# Altium schematic sheet pagerv2IO.SchDoc
size A4; SheetNumber: 2; SheetTotal: 2
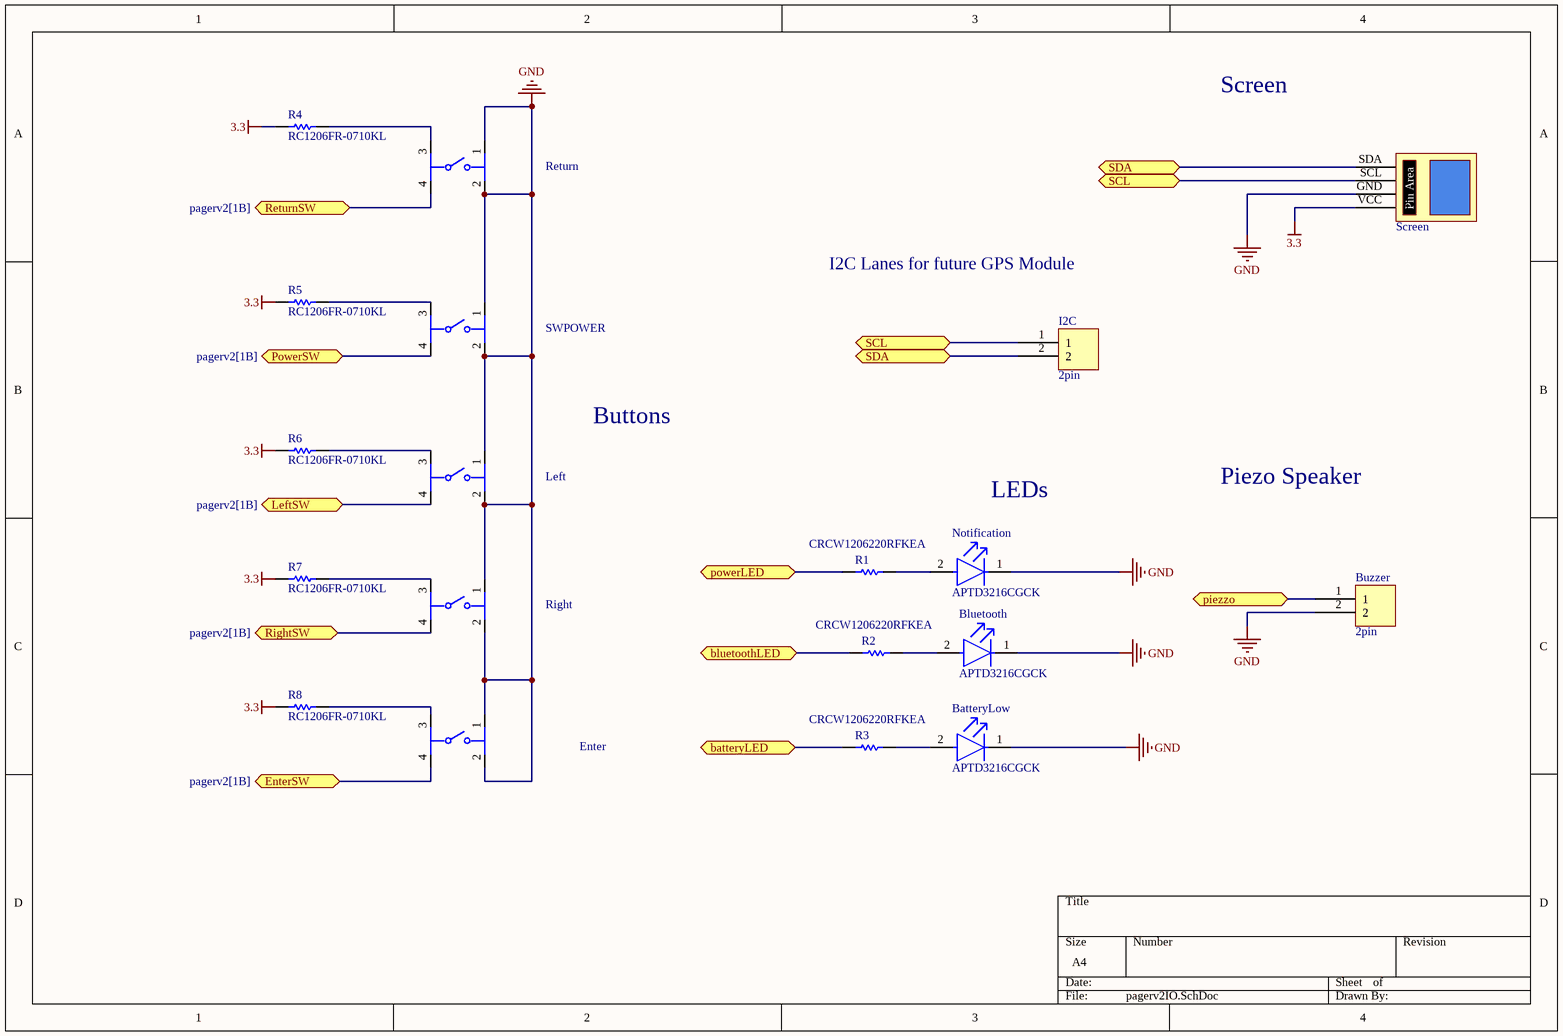
[diagram p0: pagerv2IO.SchDoc]

## Parts
?  Screen  [Screen]
BatteryLow  APTD3216CGCK  [FP-APTD3216CGCK-MFG]
Bluetooth  APTD3216CGCK  [FP-APTD3216CGCK-MFG]
Buzzer  2pin  [2PIN]
Enter  PTS645SH50SMTR92LFS  [FP-PTS645SH50SMTR92LFS-MFG]  (value not drawn)
I2C  2pin  [2PIN]
Left  PTS645SH50SMTR92LFS  [FP-PTS645SH50SMTR92LFS-MFG]  (value not drawn)
Notification  APTD3216CGCK  [FP-APTD3216CGCK-MFG]
R1  CRCW1206220RFKEA  [RESC3216X60X45ML10T20]
R2  CRCW1206220RFKEA  [RESC3216X60X45ML10T20]
R3  CRCW1206220RFKEA  [RESC3216X60X45ML10T20]
R4  RC1206FR-0710KL  [RESC3116X65X40ML10T20]
R5  RC1206FR-0710KL  [RESC3116X65X40ML10T20]
R6  RC1206FR-0710KL  [RESC3116X65X40ML10T20]
R7  RC1206FR-0710KL  [RESC3116X65X40ML10T20]
R8  RC1206FR-0710KL  [RESC3116X65X40ML10T20]
Return  PTS645SH50SMTR92LFS  [FP-PTS645SH50SMTR92LFS-MFG]  (value not drawn)
Right  PTS645SH50SMTR92LFS  [FP-PTS645SH50SMTR92LFS-MFG]  (value not drawn)
SWPOWER  PTS645SH50SMTR92LFS  [FP-PTS645SH50SMTR92LFS-MFG]  (value not drawn)

## Ports
batteryLED (bidir, see pagerv2[1B]), bluetoothLED (bidir, see pagerv2[1B]), EnterSW (bidir, see pagerv2[1B]), LeftSW (bidir, see pagerv2[1B]), piezzo (bidir, see pagerv2[2B]), powerLED (bidir, see pagerv2[1B]), PowerSW (bidir, see pagerv2[1B]), ReturnSW (bidir, see pagerv2[1B]), RightSW (bidir, see pagerv2[1B]), SCL (bidir, see pagerv2[2B], pagerv2IO[3A]), SCL (bidir, see pagerv2[2B], pagerv2IO[3B]), SDA (bidir, see pagerv2[2B], pagerv2IO[3A]), SDA (bidir, see pagerv2[2B], pagerv2IO[3B])

## Nets
3.3: ?.VCC(4) R4.1 R5.1 R6.1 R7.1 R8.1
GND: ?.GND(3) BatteryLow.1(C) Bluetooth.1(C) Buzzer.2 Enter.1 Enter.2 Left.1 Left.2 Notification.1(C) Return.1 Return.2 Right.1 Right.2 SWPOWER.1 SWPOWER.2
batteryLED: R3.1 ; port batteryLED
bluetoothLED: R2.1 ; port bluetoothLED
EnterSW: Enter.4 ; port EnterSW
LeftSW: Left.4 ; port LeftSW
piezzo: Buzzer.1 ; port piezzo
powerLED: R1.1 ; port powerLED
PowerSW: SWPOWER.4 ; port PowerSW
ReturnSW: Return.4 ; port ReturnSW
RightSW: Right.4 ; port RightSW
SCL: ?.SCL(2) I2C.1 ; port SCL
SDA: ?.SDA(1) I2C.2 ; port SDA
NetBatteryLow_2: BatteryLow.2(A) R3.2
NetBluetooth_2: Bluetooth.2(A) R2.2
NetEnter_3: Enter.3 R8.2
NetLeft_3: Left.3 R6.2
NetNotification_2: Notification.2(A) R1.2
NetR4_2: R4.2 Return.3
NetR5_2: R5.2 SWPOWER.3
NetR7_2: R7.2 Right.3

## Notes on the sheet
- Screen
- I2C Lanes for future GPS Module
- Buttons
- LEDs
- Piezo Speaker
- (in symbol Screen) Pin Area

## Library data of the parts
BatteryLow Bluetooth Notification = CMP-2000-05792-2: LED GREEN CLEAR 2SMD; Forward Voltage: 2.1V; Forward Current: 20mA; Luminous Intensity: 300mcd; Number of LEDs: 1; Dominant Wavelength: 570nm; Viewing Angle: 50°; Lead Free: Lead Free; Lens Color: Clear; Mount: Surface Mount; Package Quantity: 2000; Height: 1.8mm; Number of Pins: 2; Test Current: 20mA; Case Code (Metric): 3216; Case/Package: 1206; Case Code (Imperial): 1206; Illumination Color: Green; Color: Green; Width: 1.6mm; Packaging: Tape and Reel; Min Operating Temperature: -40°C; Lens Style: Clear; Max Operating Temperature: 85°C; Length: 3.2mm
Enter Left Return Right SWPOWER = CMP-10040-000028-1: SWITCH TACTILE SPST-NO 0.05A 12V; Operating Force: 200gf; Current Rating: 50mA; Illumination Type: Non-Illuminated; Actuator Material: Nylon; Throw Configuration: SPST; Switch Function: Off-Mom; Mechanical Life: 100000Cycles; Actuator Type: Standard; Packaging: Tape and Reel; Termination: Gull Wing; Max Operating Temperature: 60°C; Length: 6mm; REACH SVHC: No SVHC; Orientation: Straight; Max Voltage Rating (DC): 12V; Package Quantity: 1000; Max Current Rating: 50mA; Mount: Surface Mount; Contact Material: Bronze; Case/Package: SMD/SMT; Lead Free: Lead Free; Min Operating Temperature: -20°C; Contact Plating: Silver; Color: Black; Depth: 9mm; Voltage Rating (DC): 12V
R1-R3 = CMP-2003-01956-1: Manufacturer: Vishay Dale; Part Number: CRCW1206220RFKEA
R4-R8 = CMP-1014-00623-2: Chip Resistor, 10 KOhm, +/- 1%, 0.25 W, -55 to 155 degC, 1206 (3216 Metric), RoHS, Tape and Reel; Manufacturer: Yageo; Voltage Rating: 200V; Resistance: 10KOhm; Temperature Coefficient: 100ppm/degreesC; Power Rating: 250mW; Packaging: TapeandReel; Termination: SMD/SMT; REACH SVHC: Unknown; Tolerance: 1%; Height: 0.55mm; Composition: ThickFilm; Max Operating Temperature: 155degC; Datasheet Version: Rev. 5, 10/2016; Lead Free: LeadFree; Case Code (Metric): 3216; Depth: 1.6mm; Package Quantity: 5000; RoHSCompliant: true; Military Standard: Not; Case/Package: 1206; Case Code (Imperial): 1206; Min Operating Temperature: -55degC; Datasheet URL: http://www.yageo.com/NewPortal/yageodocoutput?fileName=/pdf/R-Chip/PYu-RC_Group_51_RoHS_L_5.pdf; Length: 3.1mm; Manufacturer URL: http://www.yageo.com/; Package Reference: 1206.0; Width: 1.6mm; Package Description: 2-Pin Surface Mount Device, Body 3.1 x 1.6 mm